# EAGLE design postkasse (EAGLE 7.2.0)
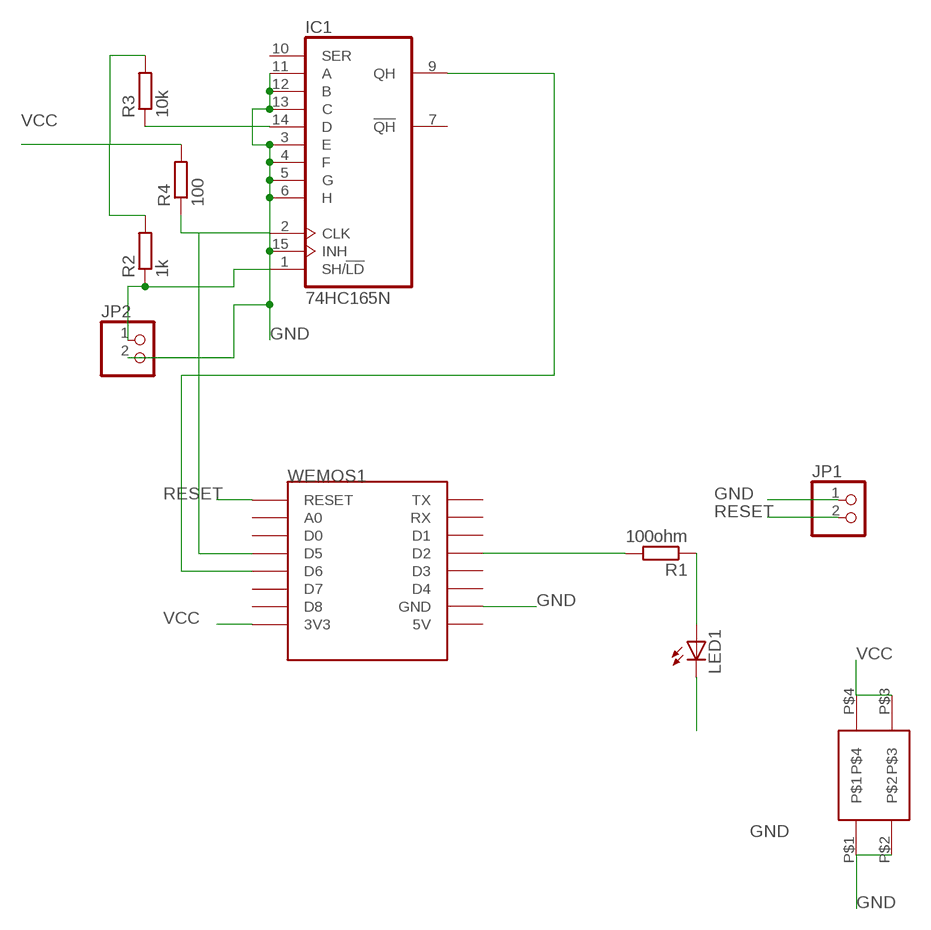
[diagram p0: schematic, sheet 1]

## Parts
IC1  74HC165N  [DIL16]
JP1  PINHD-1X2  [1X02]
JP2  PINHD-1X2  [1X02]
LED1  LED5MM  [LED5MM]
R1  100ohm  R-EU_0204/7  [0204/7]
R2  1k  R-EU_0204/7  [0204/7]
R3  10k  R-EU_0204/7  [0204/7]
R4  100  R-EU_0204/7  [0204/7]
U$1  BAT18650  [BAT18650]
WEMOS1  WEMOS-D1-MINI  [WEMOS-D1-MINI]

## Nets
GND: IC1.3(E) IC1.4(F) IC1.5(G) IC1.6(H) IC1.11(A) IC1.12(B) IC1.13(C) IC1.15(INH) JP1.1 JP2.2 LED1.K(C) U$1.P$1 U$1.P$2 WEMOS1.GND
N$1: LED1.A R1.1
N$2: R1.2 WEMOS1.D2
N$7: IC1.1(SH/!LD) JP2.1 R2.1
N$8: IC1.2(CLK) R4.1 WEMOS1.D5
N$9: IC1.14(D) R3.1
N$10: IC1.9(QH) WEMOS1.D6
RESET: JP1.2 WEMOS1.RESET
VCC: R2.2 R3.2 R4.2 U$1.P$3 U$1.P$4 WEMOS1.3V3
Unconnected: IC1.7(!QH) IC1.10(SER) WEMOS1.5V WEMOS1.A0 WEMOS1.D0 WEMOS1.D1 WEMOS1.D3 WEMOS1.D4 WEMOS1.D7 WEMOS1.D8 WEMOS1.RX WEMOS1.TX

## Power pins joined to a net without a drawn wire
GND: IC1.8(GND)
VCC: IC1.16(VCC)

## Library data of the parts
IC1 = 74xx-eu:74*165: 8-bit parallel load SHIFT REGISTER
JP1 JP2 = pinhead:PINHD-1X2: PIN HEADER
LED1 = adafruit:LED: LED OSRAM: - CHIPLED LG R971, LG N971, LY N971, LG Q971, LY Q971, LO R971, LY R971 LH N974, LH R974 LS Q976, LO Q976, LY Q976 LO Q996 - Hyper CHIPLED LW Q18S LB Q993, LB Q99A, LB R99A - SideLED LS A670, LO A670, LY A670, LG A670, LP A670 LB A673, LV A673, LT A673, LW A673 LH A674 LY A675 LS A676, LA A676, LO A676, LY A676, LW A676 LS A679, LY A679, LG A679 - Hyper Micro SIDELED® LS Y876, LA Y876, LO Y876, LY Y876 LT Y87S - SmartLED LW L88C, LW L88S LB L89C, LB L89S, LG L890 LS L89K, LO L89K, LY L89K LS L896, LA L896, LO L896, LY L896 - TOPLED LS T670, LO T670, LY T670, LG T670, LP T670 LSG T670, LSP T670, LSY T670, LOP T670, LYG T670 LG T671, LOG T671, LSG T671 LB T673, LV T673, LT T673, LW T673 LH T674 LS T676, LA T676, LO T676, LY T676, LB T676, LH T676, LSB T676, LW T676 LB T67C, LV T67C, LT T67C, LS T67K, LO T67K, LY T67K, LW E67C LS E67B, LA E67B, LO E67B, LY E67B, LB E67C, LV E67C, LT E67C LW T67C LS T679, LY T679, LG T679 LS T770, LO T770, LY T770, LG T770, LP T770 LB T773, LV T773, LT T773, LW T773 LH T774 LS E675, LA E675, LY E675, LS T675 LS T776, LA T776, LO T776, LY T776, LB T776 LHGB T686 LT T68C, LB T68C - Hyper Mini TOPLED® LB M676 - Mini TOPLED Santana® LG M470 LS M47K, LO M47K, LY M47K Source: http://www.osram.convergy.de/
R1-R4 = resistor:R-EU_: RESISTOR, European symbol
U$1 = mylib:BAT18650
WEMOS1 = esp8266modules:WEMOS-D1-MINI: WeMos.cc D1 mini ESP8266 module

## Board
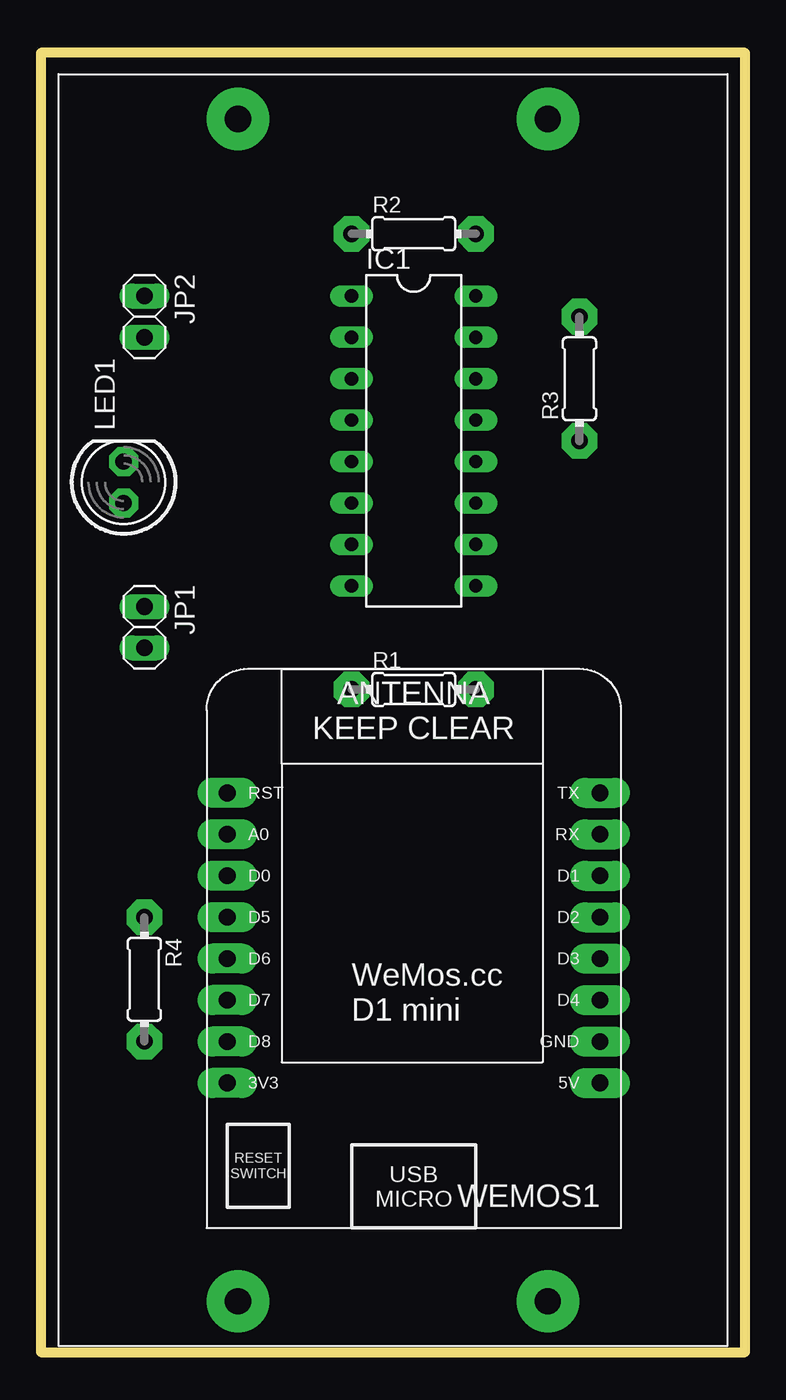
[diagram p1: board, top side]
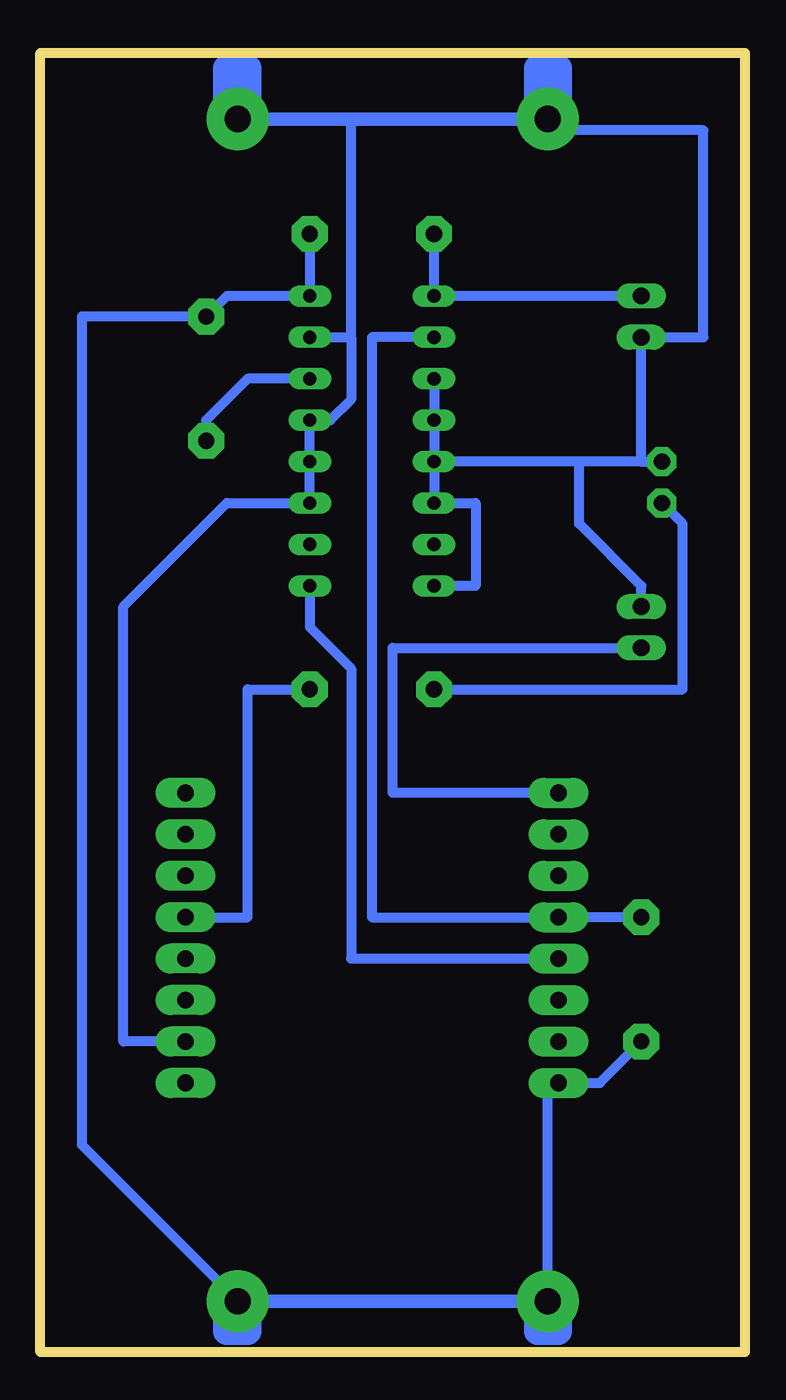
[diagram p2: board, bottom side, seen from below]

Size 43.16 x 79.68 mm. Coordinates in mm from the lower left corner, seen from the top.
Outline: 0,0 43.16,0 43.16,79.68 0,79.68 0,0
Copper layers (1*16): Top 0.035mm / dielectric 1.5mm / Bottom 0.035mm
Design rules "default": minimum track width 10mil, minimum drill 24mil, track to track 8mil, track to pad 8mil, pad to pad 8mil, via to via 8mil, smd to smd 8mil, copper to edge 40mil, drill to drill 8mil, minimum pad ring 10mil, minimum via ring 8mil, stop-mask expansion 4mil, vias tented up to drill 0mil, thermal gap 10mil
Milling: 4 lines

### Footprints (pad centres in the part's own frame; a part is rotated, then mirrored left to right if it is on the bottom)
DIL16 = drill 0.813 long: 1 -8.89,-3.81; 2 -6.35,-3.81; 3 -3.81,-3.81; 4 -1.27,-3.81; 5 1.27,-3.81; 6 3.81,-3.81; 7 6.35,-3.81; 8 8.89,-3.81; 9 8.89,3.81; 10 6.35,3.81; 11 3.81,3.81; 12 1.27,3.81; 13 -1.27,3.81; 14 -3.81,3.81; 15 -6.35,3.81; 16 -8.89,3.81
1X02 = drill 1.016 long: 1 -1.27,0; 2 1.27,0
LED5MM = drill 1 pad 1.778 octagon: A -1.27,0; K 1.27,0
0204/7 = drill 1 pad 2.184 octagon: 1 -3.81,0; 2 3.81,0
BAT18650 = drill 1.6 pad 3.81: P$1 -9.5,-36.25; P$2 9.5,-36.25; P$3 9.5,36.25; P$4 -9.5,36.25
WEMOS-D1-MINI = drill 1.016 pad 1.829 long: 3V3 -10.16,-10.16; 5V 12.7,-10.16; A0 -10.16,5.08; D0 -10.16,2.54; D1 12.7,2.54; D2 12.7,0; D3 12.7,-2.54; D4 12.7,-5.08; D5 -10.16,0; D6 -10.16,-2.54; D7 -10.16,-5.08; D8 -10.16,-7.62; GND 12.7,-7.62; RESET -10.16,7.62; RX 12.7,5.08; TX 12.7,7.62

### Placement (x,y rotation side)
IC1  22.86,55.88 270 top
JP1  6.35,44.45 270 top
JP2  6.35,63.5 270 top
LED1  5.08,53.34 90 top
R1  22.86,40.64 0 top
R2  22.86,68.58 0 top
R3  33.02,59.69 90 top
R4  6.35,22.86 270 top
U$1  21.59,39.37 180 top
WEMOS1  21.59,26.67 0 top

### Tracks (layer width: path | path; a pad name or v marks a point on that pad's centre or on a via)
GND
  Bottom 0.61: JP1.1 6.35,46.99 10.16,50.8 10.16,54.61 | IC1.3 IC1.4 IC1.5 | IC1.5 IC1.6 16.51,52.07 16.51,46.99 IC1.8 | 6.35,54.61 LED1.K | IC1.15 24.13,62.23 | 24.13,62.23 24.13,75.62 | 24.13,62.23 24.13,58.42 25.4,57.15 IC1.13 IC1.12 IC1.11 31.75,52.07 38.1,45.72 38.1,19.05 WEMOS1.GND | U$1.P$2 11.4,74.93 2.54,74.93 2.54,62.23 JP2.2 6.35,54.61 | 6.35,54.61 10.16,54.61 | 10.16,54.61 IC1.5
  Bottom 0.813: U$1.P$2 24.13,75.62 U$1.P$1
N$1
  Bottom 0.61: R1.1 3.81,40.64 3.81,50.8 LED1.A
N$2
  Bottom 0.61: WEMOS1.D2 30.48,26.67 30.48,40.64 R1.2
N$3
  Bottom 1.676: 11.43,76.2 11.43,78.74 12.7,78.74 12.7,76.2
N$4
  Bottom 1.676: 30.48,76.2 30.48,78.74 31.75,78.74 31.75,76.2
N$5
  Bottom 1.676: 11.43,2.54 11.43,1.27 12.7,1.27 12.7,2.54
N$6
  Bottom 1.676: 30.48,2.54 30.48,1.27 31.75,1.27 31.75,2.54
N$7
  Bottom 0.61: JP2.1 IC1.1 R2.1
N$8
  Bottom 0.61: R4.1 WEMOS1.D5 22.86,26.67 22.86,62.23 IC1.2
N$9
  Bottom 0.61: IC1.14 30.48,59.69 33.02,57.15 R3.1
N$10
  Bottom 0.61: IC1.9 26.67,44.45 24.13,41.91 24.13,24.13 WEMOS1.D6
RESET
  Bottom 0.61: WEMOS1.RESET 21.59,34.29 21.59,43.18 JP1.2
VCC
  Bottom 0.61: 11.43,3.12 U$1.P$3 12.09,15.85 WEMOS1.3V3 8.89,16.51 R4.2 | R2.2 IC1.16 31.75,64.77 R3.2 40.64,63.5 40.64,12.7 31.09,3.15 U$1.P$4
  Bottom 0.813: U$1.P$4 U$1.P$3